# Altium schematic sheet socket.SchDoc
size 199 x 180 mm; SheetNumber: 5; SheetTotal: 14
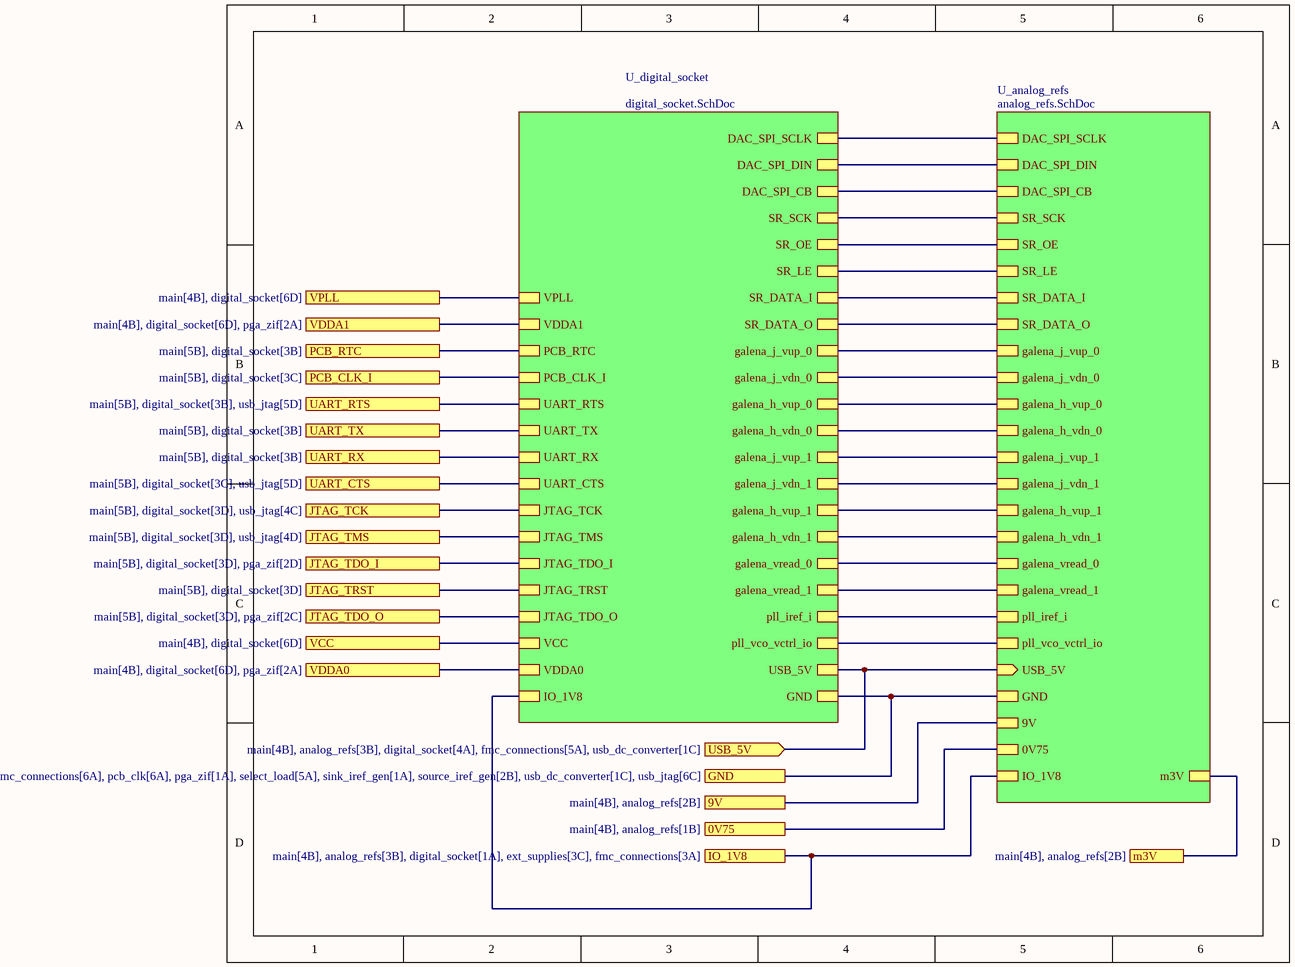
[diagram p0: socket.SchDoc]

## Sub-sheets
U_analog_refs = analog_refs.SchDoc: DAC_SPI_SCLK, DAC_SPI_DIN, DAC_SPI_CB, SR_SCK, SR_OE, SR_LE, SR_DATA_I, SR_DATA_O, galena_j_vup_0, galena_j_vdn_0, galena_h_vup_0, galena_h_vdn_0, galena_j_vup_1, galena_j_vdn_1, galena_h_vup_1, galena_h_vdn_1, IO_1V8, USB_5V (in), GND, 9V, 0V75, pll_iref_i, pll_vco_vctrl_io, galena_vread_0, galena_vread_1, m3V
U_digital_socket = digital_socket.SchDoc: IO_1V8, USB_5V, GND, DAC_SPI_SCLK, DAC_SPI_DIN, DAC_SPI_CB, SR_SCK, SR_OE, SR_LE, SR_DATA_I, SR_DATA_O, PCB_RTC, PCB_CLK_I, UART_RTS, UART_TX, UART_RX, UART_CTS, JTAG_TCK, JTAG_TMS, JTAG_TDO_I, JTAG_TRST, JTAG_TDO_O, galena_j_vup_0, galena_j_vdn_0, galena_h_vup_0, galena_h_vdn_0, galena_vread_0, pll_vco_vctrl_io, pll_iref_i, galena_j_vup_1, galena_j_vdn_1, galena_h_vup_1, galena_h_vdn_1, galena_vread_1, VCC, VDDA0, VDDA1, VPLL

## Ports
0V75 (see main[4B], analog_refs[1B]), 9V (see main[4B], analog_refs[2B]), GND (see main[4B], analog_refs[3B], digital_socket[6A], fmc_connections[6A], pcb_clk[6A], pga_zif[1A], select_load[5A], sink_iref_gen[1A], source_iref_gen[2B], usb_dc_converter[1C], usb_jtag[6C]), IO_1V8 (see main[4B], analog_refs[3B], digital_socket[1A], ext_supplies[3C], fmc_connections[3A]), JTAG_TCK (see main[5B], digital_socket[3D], usb_jtag[4C]), JTAG_TDO_I (see main[5B], digital_socket[3D], pga_zif[2D]), JTAG_TDO_O (see main[5B], digital_socket[3D], pga_zif[2C]), JTAG_TMS (see main[5B], digital_socket[3D], usb_jtag[4D]), JTAG_TRST (see main[5B], digital_socket[3D]), m3V (see main[4B], analog_refs[2B]), PCB_CLK_I (see main[5B], digital_socket[3C]), PCB_RTC (see main[5B], digital_socket[3B]), UART_CTS (see main[5B], digital_socket[3C], usb_jtag[5D]), UART_RTS (see main[5B], digital_socket[3B], usb_jtag[5D]), UART_RX (see main[5B], digital_socket[3B]), UART_TX (see main[5B], digital_socket[3B]), USB_5V (in, see main[4B], analog_refs[3B], digital_socket[4A], fmc_connections[5A], usb_dc_converter[1C]), VCC (see main[4B], digital_socket[6D]), VDDA0 (see main[4B], digital_socket[6D], pga_zif[2A]), VDDA1 (see main[4B], digital_socket[6D], pga_zif[2A]), VPLL (see main[4B], digital_socket[6D])

## Nets
0V75: port 0V75, sheet U_analog_refs/0V75
9V: port 9V, sheet U_analog_refs/9V
GND: port GND, sheet U_analog_refs/GND, sheet U_digital_socket/GND
IO_1V8: port IO_1V8, sheet U_analog_refs/IO_1V8, sheet U_digital_socket/IO_1V8
JTAG_TCK: port JTAG_TCK, sheet U_digital_socket/JTAG_TCK
JTAG_TDO_I: port JTAG_TDO_I, sheet U_digital_socket/JTAG_TDO_I
JTAG_TDO_O: port JTAG_TDO_O, sheet U_digital_socket/JTAG_TDO_O
JTAG_TMS: port JTAG_TMS, sheet U_digital_socket/JTAG_TMS
JTAG_TRST: port JTAG_TRST, sheet U_digital_socket/JTAG_TRST
m3V: port m3V, sheet U_analog_refs/m3V
PCB_CLK_I: port PCB_CLK_I, sheet U_digital_socket/PCB_CLK_I
PCB_RTC: port PCB_RTC, sheet U_digital_socket/PCB_RTC
UART_CTS: port UART_CTS, sheet U_digital_socket/UART_CTS
UART_RTS: port UART_RTS, sheet U_digital_socket/UART_RTS
UART_RX: port UART_RX, sheet U_digital_socket/UART_RX
UART_TX: port UART_TX, sheet U_digital_socket/UART_TX
USB_5V: port USB_5V, sheet U_analog_refs/USB_5V, sheet U_digital_socket/USB_5V
VCC: port VCC, sheet U_digital_socket/VCC
VDDA0: port VDDA0, sheet U_digital_socket/VDDA0
VDDA1: port VDDA1, sheet U_digital_socket/VDDA1
VPLL: port VPLL, sheet U_digital_socket/VPLL
(unnamed): sheet U_analog_refs/DAC_SPI_SCLK, sheet U_digital_socket/DAC_SPI_SCLK
(unnamed): sheet U_analog_refs/DAC_SPI_DIN, sheet U_digital_socket/DAC_SPI_DIN
(unnamed): sheet U_analog_refs/DAC_SPI_CB, sheet U_digital_socket/DAC_SPI_CB
(unnamed): sheet U_analog_refs/SR_SCK, sheet U_digital_socket/SR_SCK
(unnamed): sheet U_analog_refs/SR_OE, sheet U_digital_socket/SR_OE
(unnamed): sheet U_analog_refs/SR_LE, sheet U_digital_socket/SR_LE
(unnamed): sheet U_analog_refs/SR_DATA_I, sheet U_digital_socket/SR_DATA_I
(unnamed): sheet U_analog_refs/SR_DATA_O, sheet U_digital_socket/SR_DATA_O
(unnamed): sheet U_analog_refs/galena_j_vup_0, sheet U_digital_socket/galena_j_vup_0
(unnamed): sheet U_analog_refs/galena_j_vdn_0, sheet U_digital_socket/galena_j_vdn_0
(unnamed): sheet U_analog_refs/galena_h_vup_0, sheet U_digital_socket/galena_h_vup_0
(unnamed): sheet U_analog_refs/galena_h_vdn_0, sheet U_digital_socket/galena_h_vdn_0
(unnamed): sheet U_analog_refs/galena_j_vup_1, sheet U_digital_socket/galena_j_vup_1
(unnamed): sheet U_analog_refs/galena_j_vdn_1, sheet U_digital_socket/galena_j_vdn_1
(unnamed): sheet U_analog_refs/galena_h_vup_1, sheet U_digital_socket/galena_h_vup_1
(unnamed): sheet U_analog_refs/galena_h_vdn_1, sheet U_digital_socket/galena_h_vdn_1
(unnamed): sheet U_analog_refs/pll_iref_i, sheet U_digital_socket/pll_iref_i
(unnamed): sheet U_analog_refs/pll_vco_vctrl_io, sheet U_digital_socket/pll_vco_vctrl_io
(unnamed): sheet U_analog_refs/galena_vread_0, sheet U_digital_socket/galena_vread_0
(unnamed): sheet U_analog_refs/galena_vread_1, sheet U_digital_socket/galena_vread_1